# Altium schematic sheet buck_CONVERTER.SchDoc
size A4
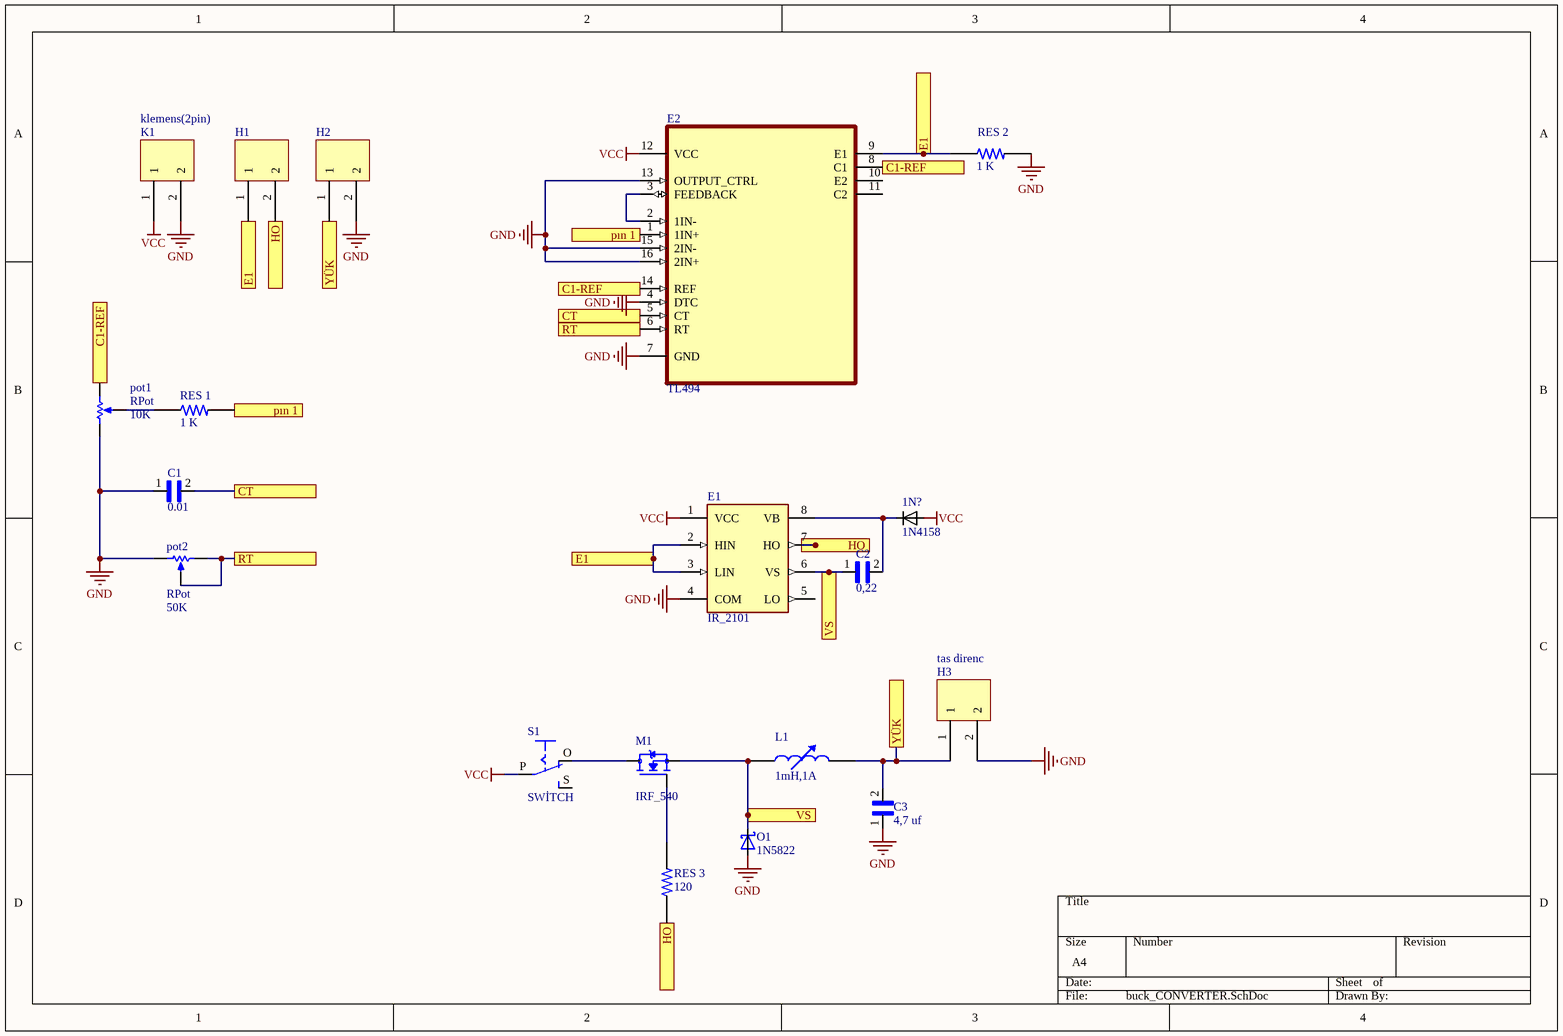
[diagram p0: buck_CONVERTER.SchDoc]

## Parts
1N?  1N4158  [1N4158]
C1  0.01  [0,01 uf]
C2  0,22  [22uf CAP]
C3  4,7 uf  [4,7 uf]
E1  IR_2101  [IR_2101]
E2  TL494  [TL_494]
H1  (no value)  [HEADEDR 2]
H2  (no value)  [HEADEDR 2]
H3  tas direnc  [HEADEDR 2]
K1  klemens(2pin)  [klemens]
L1  1mH,1A  [INDUCTOR]
M1  IRF_540  [IRF_540]
O1  1N5822  [1N5822]
pot1  RPot  value 10K  [POT]
pot2  RPot  value 50K  [POT]
RES_1  1 K  [res]
RES_2  1 K  [res]
RES_3  120  [res]
S1  SWİTCH  [SWİTCH]

## Ports
C1-REF, CT, E1, HO, pın 1, RT, VS, YÜK

## Nets
GND: C1.1 C3.1 E1.4(COM) E2.4(DTC) E2.7(GND) E2.13(OUTPUT_CTRL) E2.15(2IN-) E2.16(2IN+) H2.2 H3.2 K1.2 O1.A pot1.1(TOP) pot2.1(TOP) RES_2.2
VCC: 1N?.A E1.1(VCC) E2.12(VCC) K1.1 S1.P
C1-REF: E2.8(C1) E2.14(REF) pot1.2(BOT) ; port C1-REF
CT: C1.2 E2.5(CT) ; port CT
E1: E1.2(HIN) E1.3(LIN) E2.9(E1) H1.1 RES_2.1 ; port E1
HO: E1.7(HO) H1.2 RES_3.1 ; port HO
pın 1: E2.1(1IN+) RES_1.2 ; port pın 1
RT: E2.6(RT) pot2.2(BOT) pot2.3(TAP) ; port RT
VS: C2.1 E1.6(VS) L1.1 M1.3(S) O1.C ; port VS
YÜK: C3.2 H2.1 H3.1 L1.2 ; port YÜK
Net1N?_C: 1N?.C C2.2 E1.8(VB)
NetE2_2: E2.2(1IN-) E2.3(FEEDBACK)
NetM1_1: M1.1(G) RES_3.2
NetM1_2: M1.2(D) S1.O
Netpot1_3: pot1.3(TAP) RES_1.1

Not connected (* = marked no-connect by the designer): E1 5(LO); E2 10(E2) 11(C2); S1 S

## Library data of the parts
C1 = 0,01 uf
C2 = CAP
H1-H3 = HEADER 2
L1 = inductor
pot1 pot2 = RPot: Potentiometer; Sim Note: Enter the Resistance value and the set point into parameter fields.; Set Position: 0.5; Published: 8-Jun-2000; LatestRevisionDate: 17-Jul-2002; LatestRevisionNote: Re-released for DXP Platform.; PackageReference: VR5; Publisher: Altium Limited; PackageDescription: Variable Resistor, Thru-Hole; 3 Leads
RES_1-RES_3 = res